# Altium schematic sheet Sheet9.SchDoc: solar-powered-remote-water-level-relay
size 419 x 297 mm; Date: 2026/06/29; Author: forlook88@gmail.com; Revision: 0; SheetNumber: 9; SheetTotal: 11
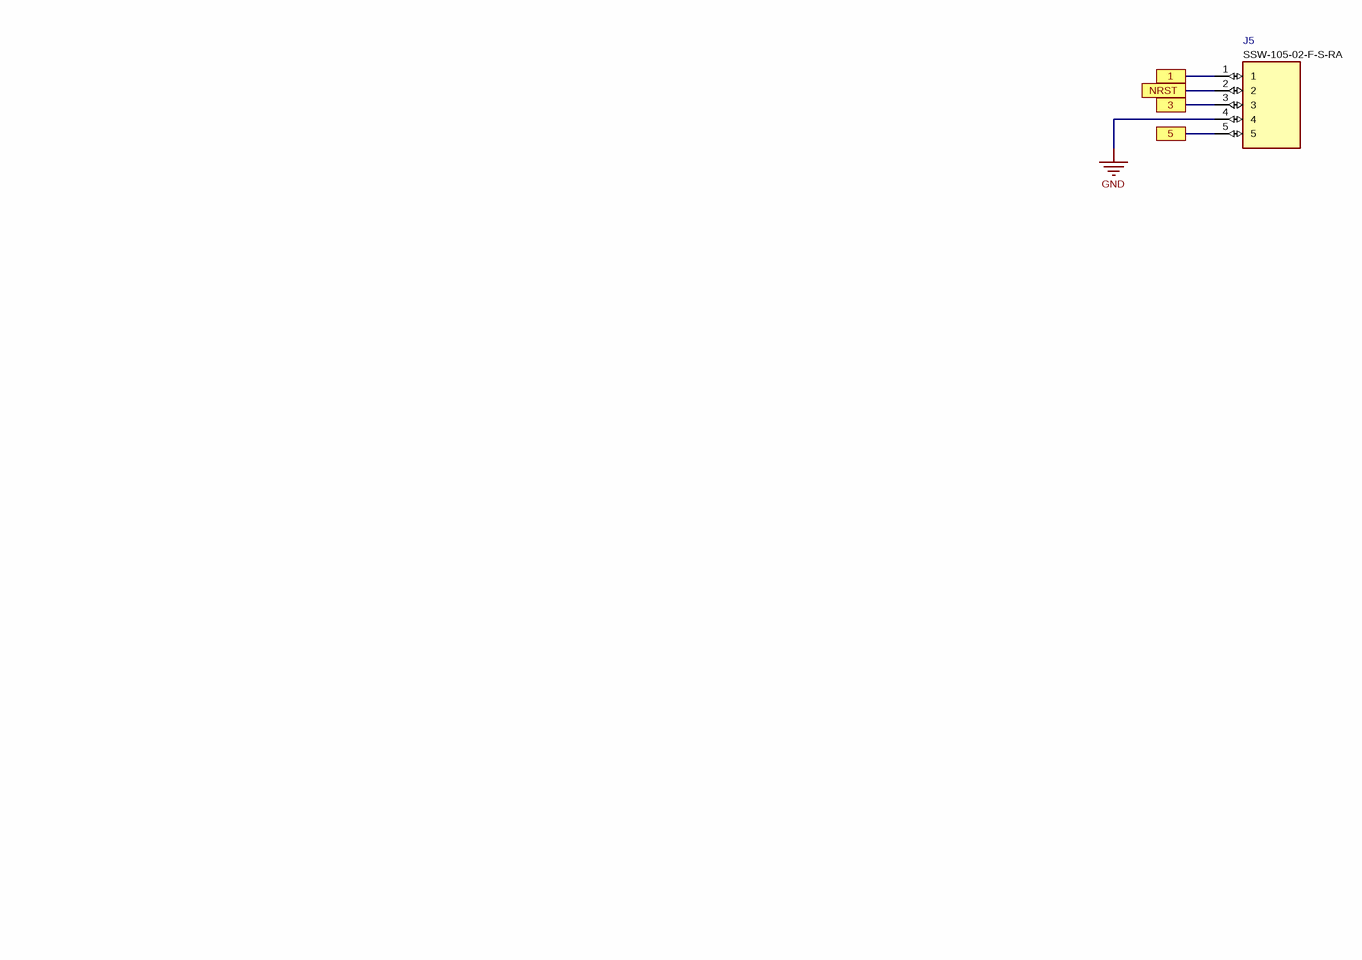
[diagram p0: Sheet9.SchDoc]

## Parts
J5  value SSW-105-02-F-S-RA

## Ports
1, 3, 5, NRST

## Nets
GND: J5.4
1: J5.1 ; port 1
3: J5.3 ; port 3
5: J5.5 ; port 5
NRST: J5.2 ; port NRST

## Notes on the sheet
- Document Name:
- Project Name:
- Sheet Name:
- Sheet Number:
- Author:
- CELUS Design Platform electronic designs are machine-generated drafts and require verification by qualified specialists.
- of
- Revision:
- Date:
- By using these designs, you agree to the CELUS Terms of Use: https://www.celus.io/terms-of-use

## Library data of the parts
J5 = (no symbol name): Manufacturer: SAMTEC; Manufacturer Part Number: SSW-105-02-F-S-RA